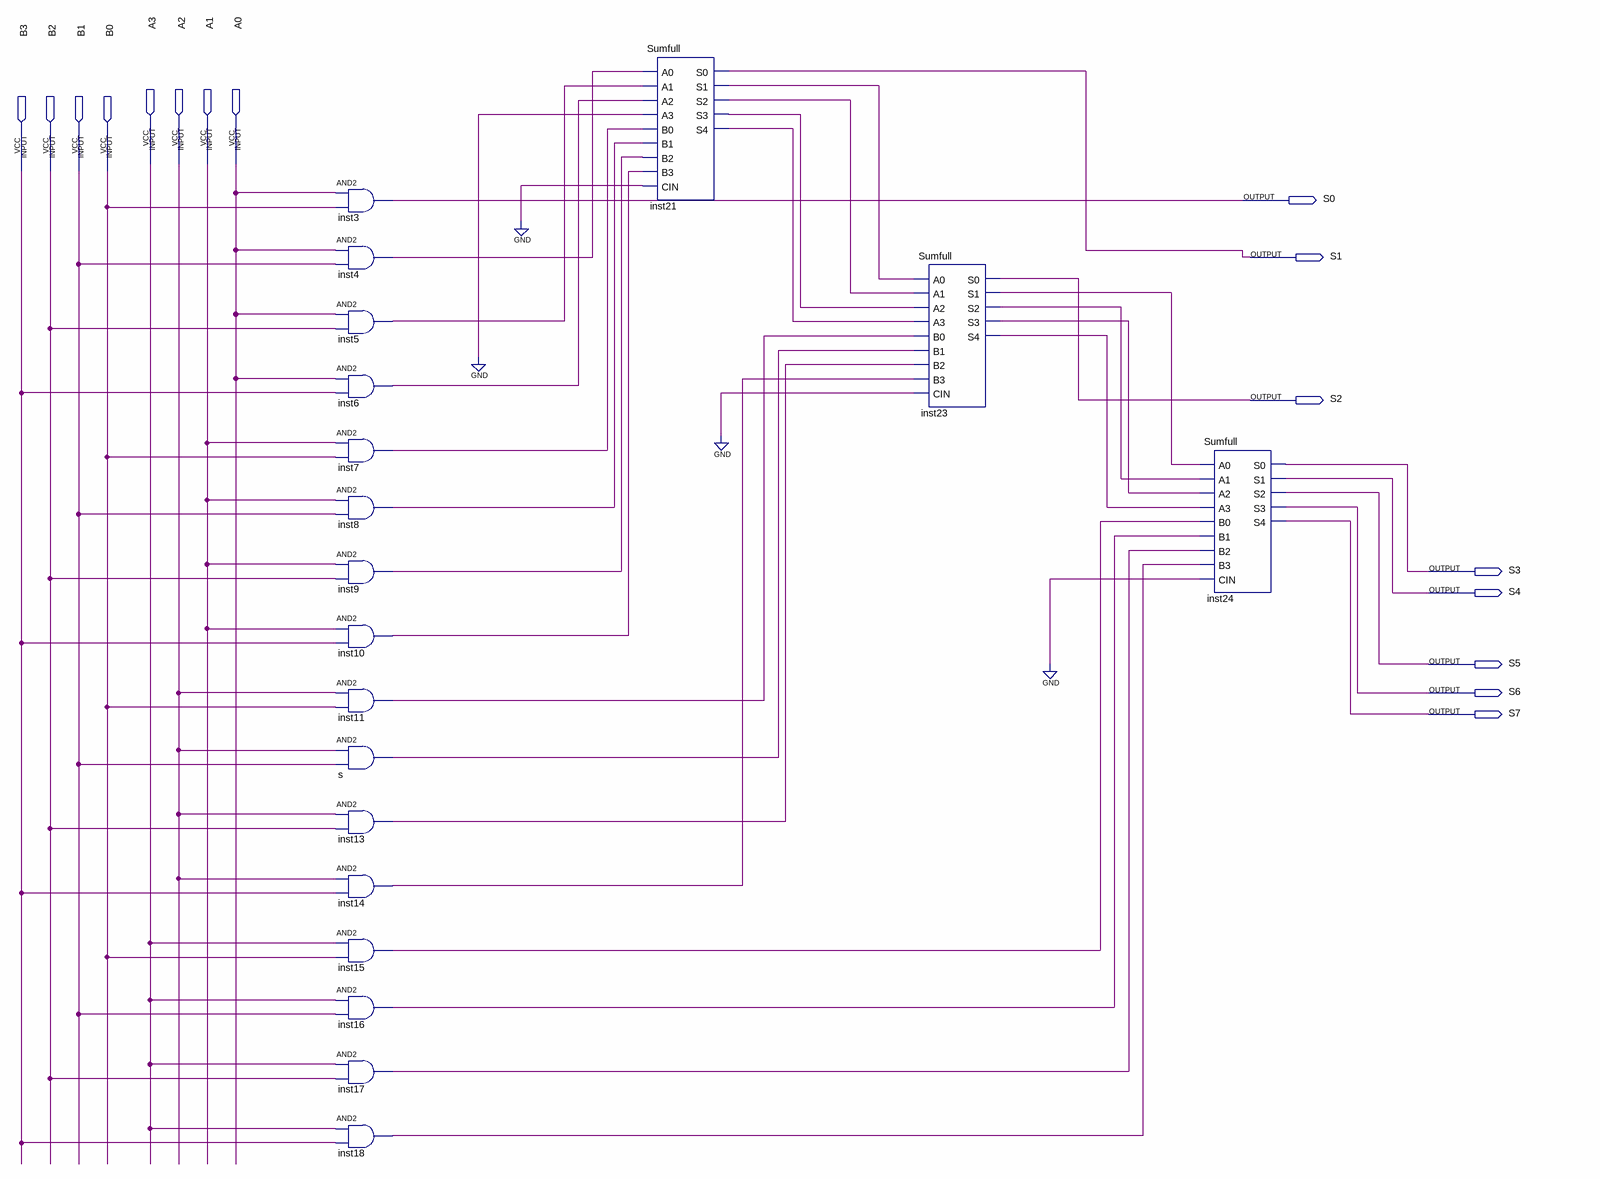
[diagram p0: schematic sheet]
// Quartus schematic Multiplicador.bdf as structural Verilog: 19 symbols, 16 pins
module Multiplicador (
  input  A3,
  input  A2,
  input  A1,
  input  A0,
  input  B3,
  input  B2,
  input  B1,
  input  B0,
  output S0,
  output S1,
  output S2,
  output S3,
  output S4,
  output S5,
  output S6,
  output S7
);

  wire inst4_out, inst5_out, inst6_out, inst7_out, inst8_out, inst9_out, inst10_out, inst11_out, inst13_out,
       inst14_out, inst15_out, inst16_out, inst17_out, inst18_out, inst21_s1, inst21_s2, inst21_s3,
       inst21_s4, inst23_s1, inst23_s2, inst23_s3, inst23_s4, s_out;

  and inst3 (S0, A0, B0);
  and inst4 (inst4_out, A0, B1);
  and inst5 (inst5_out, A0, B2);
  and inst6 (inst6_out, A0, B3);
  and inst7 (inst7_out, A1, B0);
  and inst8 (inst8_out, A1, B1);
  and inst9 (inst9_out, A1, B2);
  and inst10 (inst10_out, A1, B3);
  and inst11 (inst11_out, A2, B0);
  and s (s_out, A2, B1);
  and inst13 (inst13_out, A2, B2);
  and inst14 (inst14_out, A2, B3);
  and inst15 (inst15_out, A3, B0);
  and inst16 (inst16_out, A3, B1);
  and inst17 (inst17_out, A3, B2);
  and inst18 (inst18_out, A3, B3);
  Sumfull inst21 (
    .A0(inst4_out), .A1(inst5_out), .A2(inst6_out), .A3(1'b0), .B0(inst7_out), .B1(inst8_out),
    .B2(inst9_out), .B3(inst10_out), .CIN(1'b0), .S0(S1), .S1(inst21_s1), .S2(inst21_s2), .S3(inst21_s3),
    .S4(inst21_s4));
  Sumfull inst23 (
    .A0(inst21_s1), .A1(inst21_s2), .A2(inst21_s3), .A3(inst21_s4), .B0(inst11_out), .B1(s_out),
    .B2(inst13_out), .B3(inst14_out), .CIN(1'b0), .S0(S2), .S1(inst23_s1), .S2(inst23_s2), .S3(inst23_s3),
    .S4(inst23_s4));
  Sumfull inst24 (
    .A0(inst23_s1), .A1(inst23_s2), .A2(inst23_s3), .A3(inst23_s4), .B0(inst15_out), .B1(inst16_out),
    .B2(inst17_out), .B3(inst18_out), .CIN(1'b0), .S0(S3), .S1(S4), .S2(S5), .S3(S6), .S4(S7));
endmodule
